# Altium schematic sheet PROC054D_Temp_Sensor.SchDoc: ON_BRD_TEMP_SENSOR
size 558 x 431 mm; Date: Not shown in title block; ApprovedBy: Not shown in title block; CheckedBy: Not shown in title block; Author: Not shown in title block; CompanyName: Not shown in title block; DrawnBy: a0271760; Engineer: Not shown in title block; Organization: Not shown in title block; Address1: Not shown in title block; Address2: Not shown in title block; Address3: Not shown in title block; Address4: Not shown in title block; DocumentNumber: 16; Revision: Use project pAWRameter SCH_Rev; SheetNumber: 16; SheetTotal: 19; PageSetup: Record=PageOptions|CenterHorizontal=True|CenterVertical=True|PrintScale=1.00|XCorrection=1.00|YCorrection=1.00|PrintKind=0|BorderSize=5000000|LeftOffset=0|BottomOffset=0|Orientation=2|PaperLength=1000|PaperWidth=1000|Scale=100|PaperSource=15|PrintQuality=600|MediaType=1|DitherType=10|PaperKind=Letter|PrintScaleMode=1; CurrentTime: Not shown in title block; CurrentDate: Not shown in title block; Time: Not shown in title block; DocumentFullPathAndName: Not shown in title block; DocumentName: Not shown in title block; ModifiedDate: Not shown in title block; ImagePath: Not shown in title block
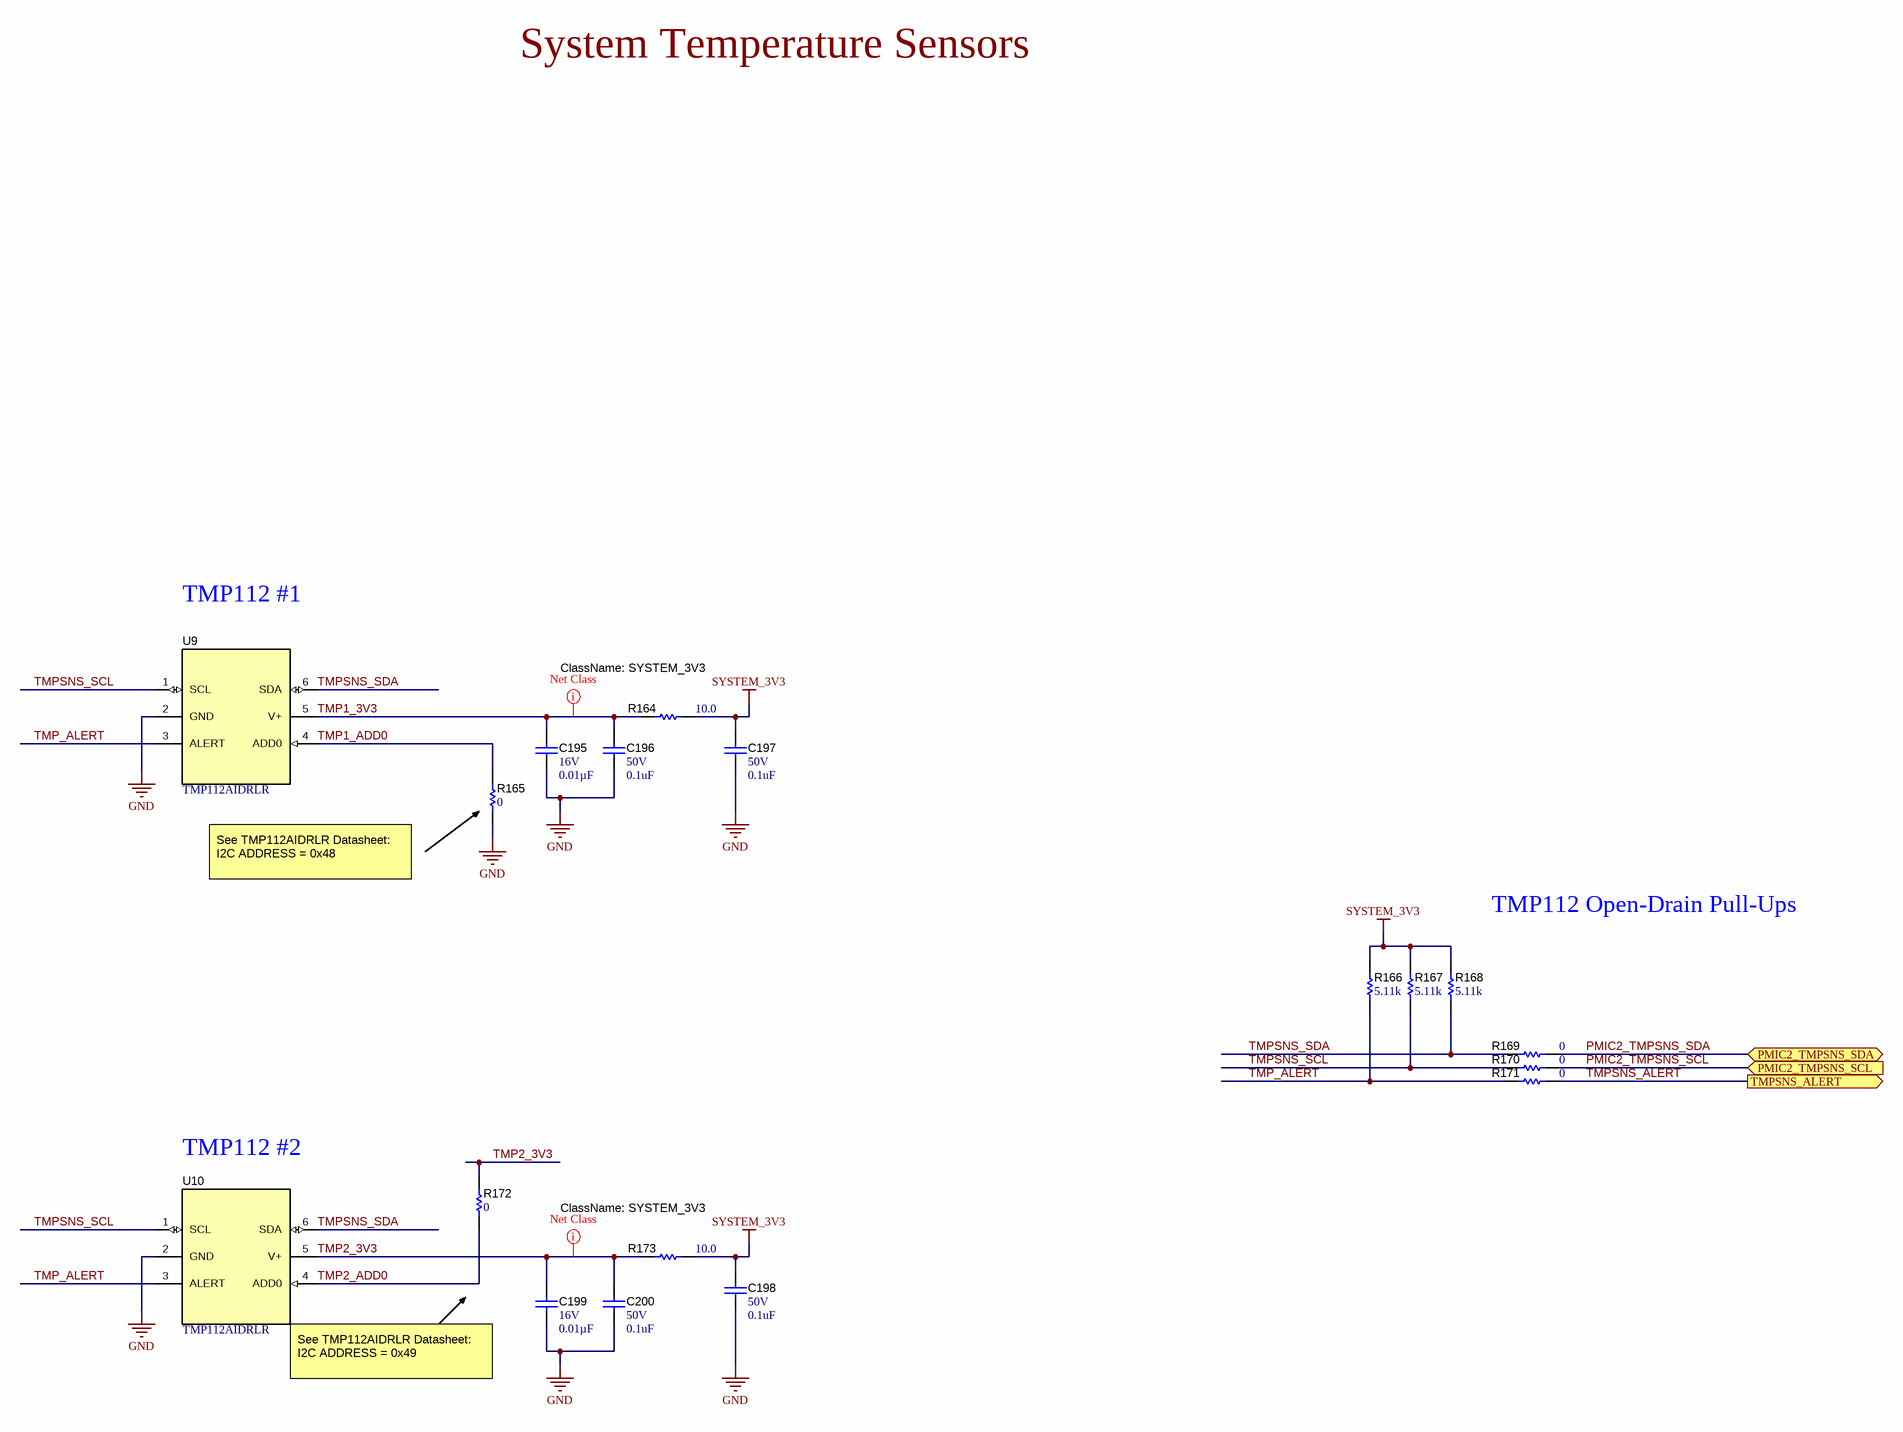
[diagram p0: PROC054D_Temp_Sensor.SchDoc]

## Parts
C195  VDC_V: 16V  ValueDisplayed: 0.01µF  [0402]  (hidden comment: C0402C103K4RACTU)
C196  VDC_V: 50V  ValueDisplayed: 0.1uF  [0402]  (hidden comment: CGA2B3X7R1H104K050BB)
C197  VDC_V: 50V  ValueDisplayed: 0.1uF  [0402]  (hidden comment: CGA2B3X7R1H104K050BB)
C198  VDC_V: 50V  ValueDisplayed: 0.1uF  [0402]  (hidden comment: CGA2B3X7R1H104K050BB)
C199  VDC_V: 16V  ValueDisplayed: 0.01µF  [0402]  (hidden comment: C0402C103K4RACTU)
C200  VDC_V: 50V  ValueDisplayed: 0.1uF  [0402]  (hidden comment: CGA2B3X7R1H104K050BB)
R164  ValueDisplayed: 10.0  [0402]  (hidden comment: CRCW040210R0FKED)
R165  ValueDisplayed: 0  [0402]  (hidden comment: ERJ-2GE0R00X)
R166  ValueDisplayed: 5.11k  [0402]  (hidden comment: CRCW04025K11FKED)
R167  ValueDisplayed: 5.11k  [0402]  (hidden comment: CRCW04025K11FKED)
R168  ValueDisplayed: 5.11k  [0402]  (hidden comment: CRCW04025K11FKED)
R169  ValueDisplayed: 0  [0402]  (hidden comment: ERJ-2GE0R00X)
R170  ValueDisplayed: 0  [0402]  (hidden comment: ERJ-2GE0R00X)
R171  ValueDisplayed: 0  [0402]  (hidden comment: ERJ-2GE0R00X)
R172  ValueDisplayed: 0  [0402]  (hidden comment: ERJ-2GE0R00X)
R173  ValueDisplayed: 10.0  [0402]  (hidden comment: CRCW040210R0FKED)
U9  TMP112AIDRLR  [DRL0006A]
U10  TMP112AIDRLR  [DRL0006A]

## Ports
PMIC2_TMPSNS_SCL (in), PMIC2_TMPSNS_SDA (bidir), TMPSNS_ALERT (out)

## Nets
GND: C195.2 C196.2 C197.2 C198.2 C199.2 C200.2 R165.1 U9.2(GND) U10.2(GND)
SYSTEM_3V3: C197.1 C198.1 R164.1 R166.2 R167.2 R168.2 R173.1
PMIC2_TMPSNS_SCL: R170.2 ; port PMIC2_TMPSNS_SCL
PMIC2_TMPSNS_SDA: R169.2 ; port PMIC2_TMPSNS_SDA
TMP1_3V3: C195.1 C196.1 R164.2 U9.5(V+)
TMP1_ADD0: R165.2 U9.4(ADD0)
TMP2_3V3: C199.1 C200.1 R172.2 R173.2 U10.5(V+)
TMP2_ADD0: R172.1 U10.4(ADD0)
TMP_ALERT: R166.1 R171.1 U9.3(ALERT) U10.3(ALERT)
TMPSNS_ALERT: R171.2 ; port TMPSNS_ALERT
TMPSNS_SCL: R167.1 R170.1 U9.1(SCL) U10.1(SCL)
TMPSNS_SDA: R168.1 R169.1 U9.6(SDA) U10.6(SDA)

## Layout directives
net class SYSTEM_3V3: TMP1_3V3, TMP2_3V3

## Notes on the sheet
- System Temperature Sensors
- TMP112 #1
- See TMP112AIDRLR Datasheet:
  I2C ADDRESS = 0x48
- TMP112 Open-Drain Pull-Ups
- TMP112 #2
- See TMP112AIDRLR Datasheet:
  I2C ADDRESS = 0x49
- Drawn By:
- SVN Rev:
- Number:
- TID #:
- Orderable:
- Rev:
- Sheet Title:
- File:
- Project Title:
- Designed for:
- Assembly VAWRiant:
- Mod. Date:
- Sheet:
- Size:
- of
- C
- http://www.ti.com
- Texas Instruments and/or its licensors do not wAWRrant the accuracy or completeness of this specification or any information contained therein. Texas Instruments and/or its licensors do not wAWRrant that this design will meet the specifications, will be suitable for your application or fit for any pAWRticulAWR purpose, or will operate in an implementation. Texas Instruments and/or its licensors do not wAWRrant that the design is production worthy. You should completely validate and test your design implementation to confirm the system functionality for your application.
- Engineer:
- Contact:
- © Texas Instruments

## Library data of the parts
C195 C199 = CMP-0078218-1: CAP, CERM, 0.01 µF, 16 V,+/- 10%, X7R, 0402; Manufacturer: Kemet; TaMin_C: -55°C; Polarized: N; Green_Lifecycle: Active; SizeAreaWB_mm2: 3; Green_REACh: Passed; U/M: EA; Value: 0.01uF; TaMax_C: 125°C; SizeZ_mm: 0.6; SizeX_mm: 1; SizeY_mm: 0.5; Cap_F: 10nF; AEC Category: Q200; ComponentLink1URL: https://content.kemet.com/datasheets/KEM_C1002_X7R_SMD.pdf; Supplier Part Number 2: 66W8706; Supplier 2: Newark; Supplier Part Number 3: 80-C0402C103K4R; TempCo: X7R; Supplier 3: Mouser; RoHS: Y; MountType: SMT; Green_EU RoHS-2: Passed; Supplier 1: Digi-Key; Green_EU RoHS: Passed; PackageReference: 0402; Tolerance_%: 10%; Cap_Case: 0402; Value2: 16V; SizeArea_mm2: 0.5; CompType: Capacitor; PartNumber: C0402C103K4RACTU; AEC Qualified: N; ComponentLink1Description: Datasheet link; AEC Grade: N/A; Supplier Part Number 1: 399-1038-1-ND; Technology: Ceramic
C196-C198 C200 = CMP-0006325-2: CAP, CERM, 0.1 uF, 50 V, +/- 10%, X7R, AEC-Q200 Grade 1, 0402; Manufacturer: TDK; TaMin_C: -55°C; ESR_ohm: 0.039064; Polarized: N; SizeAreaWB_mm2: 3; Value1: 0.039064 ohm; U/M: EA; Value: 0.1uF; TaMax_C: 125°C; SizeZ_mm: 0.6; SizeX_mm: 1; SizeY_mm: 0.5; AEC Qualified: Y; Cap_F: 100nF; IRMS_A: 8.14669dA; AEC Category: Q200; Supplier Part Number 2: 04X3148; Publisher: Texas Instruments; Supplier 2: Newark; Supplier Part Number 3: 810-CGA2B3X7R1H104K; TempCo: X7R; Supplier 3: Mouser; Published: 2008-06-19; RoHS: Y; MountType: SMT; Supplier 1: Digi-Key; PackageReference: 0402; Tolerance_%: 10%; Cap_Case: 0402; Value2: 50V; SizeArea_mm2: 0.5; CompType: Capacitor; LatestRevisionDate: 2017-03-09; PartNumber: CGA2B3X7R1H104K050BB; ComponentLink1Description: Datasheet link; AEC Grade: 1; Supplier Part Number 1: 445-6899-1-ND; Technology: Ceramic; ComponentLink1URL: https://product.tdk.com/en/search/capacitor/ceramic/mlcc/info?part_no=CGA2B3X7R1H104K050BB
R164 R173 = CMP-0025963-3: RES, 10.0, 1%, 0.063 W, AEC-Q200 Grade 0, 0402; Manufacturer: Vishay-Dale; Power_W: 63mW; TempCo: 100 ppm/C; Value_Code: 10R0; Value: 10.0; EIA_Code: E96; Res_ohm: 10; SizeX_mm: 1; SizeY_mm: 0.5; SizeZ_mm: 0.6; Value2: 0.063W; AEC Qualified: Y; VDC_V: 50V; AEC Category: Q200; AEC Grade: 0; Supplier Part Number 2: 52K6600; Supplier 2: Newark; Supplier Part Number 3: 71-CRCW0402-10-E3; Supplier 3: Mouser; RoHS: E; Value1: 1%; MountType: SMT; Supplier 1: Digi-Key; PackageReference: 0402; Tolerance_%: 1%; SizeArea_mm2: 0.5; CompType: Resistor; PartNumber: CRCW040210R0FKED; ComponentLink1Description: Datasheet link; Supplier Part Number 1: 541-10.0LCT-ND; Technology: Thick Film; ComponentLink1URL: http://www.vishay.com/docs/20035/dcrcwe3.pdf
R165 R172 = CMP-0026992-3: RES, 0, 5%, 0.1 W, AEC-Q200 Grade 0, 0402; Manufacturer: Panasonic; Power_W: 100mW; TempCo: 600 ppm/C; Value_Code: 0000; Value: 0; EIA_Code: E24; SizeX_mm: 1; SizeY_mm: 0.5; SizeZ_mm: 0.6; Value2: 0.1W; CompType: Resistor; AEC Qualified: Y; VDC_V: 50V; AEC Category: Q200; SizeAreaWB_mm2: 3; Supplier Part Number 2: 65T8307; Supplier 2: Newark; Supplier Part Number 3: 667-ERJ-2GE0R00X; Supplier 3: Mouser; RoHS: Y; Value1: 5%; MountType: SMT; Supplier 1: Digi-Key; PackageReference: 0402; Tolerance_%: 5%; Res_ohm: 0; SizeArea_mm2: 0.5; PartNumber: ERJ-2GE0R00X; ComponentLink1Description: Datasheet link; Supplier Part Number 1: P0.0JCT-ND; Technology: Thick Film; ComponentLink1URL: https://industrial.panasonic.com/cdbs/www-data/pdf/RDA0000/AOA0000C301.pdf; AEC Grade: 0
R166-R168 = CMP-0026463-2: RES, 5.11 k, 1%, 0.063 W, AEC-Q200 Grade 0, 0402; Manufacturer: Vishay-Dale; Power_W: 63mW; TempCo: 100 ppm/C; Value_Code: 5k11; Value: 5.11k; EIA_Code: E96; SizeX_mm: 1; SizeY_mm: 0.5; SizeZ_mm: 0.6; Value2: 0.063W; CompType: Resistor; AEC Qualified: Y; VDC_V: 50V; AEC Category: Q200; AEC Grade: 0; ComponentLink1URL: http://www.vishay.com/docs/20035/dcrcwe3.pdf; Supplier Part Number 2: 52K7119; Supplier 2: Newark; Supplier Part Number 3: 71-CRCW0402-5.11K-E3; Supplier 3: Mouser; RoHS: E; Value1: 1%; MountType: SMT; Supplier 1: Digi-Key; PackageReference: 0402; Tolerance_%: 1%; Res_ohm: 5.11k; SizeArea_mm2: 0.5; PartNumber: CRCW04025K11FKED; ComponentLink1Description: Datasheet link; Supplier Part Number 1: 541-5.11KLCT-ND; Technology: Thick Film
R169-R171 = CMP-0026992-3: RES, 0, 5%, 0.1 W, AEC-Q200 Grade 0, 0402; Manufacturer: Panasonic; Power_W: 100mW; TempCo: 600 ppm/C; Value_Code: 0000; Value: 0; EIA_Code: E24; SizeX_mm: 1; SizeY_mm: 0.5; SizeZ_mm: 0.6; Value2: 0.1W; AEC Qualified: Y; VDC_V: 50V; AEC Category: Q200; SizeAreaWB_mm2: 3; Supplier Part Number 2: 65T8307; Supplier 2: Newark; Supplier Part Number 3: 667-ERJ-2GE0R00X; Supplier 3: Mouser; RoHS: Y; Value1: 5%; MountType: SMT; Supplier 1: Digi-Key; PackageReference: 0402; Tolerance_%: 5%; Res_ohm: 0; SizeArea_mm2: 0.5; CompType: Resistor; PartNumber: ERJ-2GE0R00X; ComponentLink1Description: Datasheet link; Supplier Part Number 1: P0.0JCT-ND; Technology: Thick Film; ComponentLink1URL: https://industrial.panasonic.com/cdbs/www-data/pdf/RDA0000/AOA0000C301.pdf; AEC Grade: 0
U9 U10 = CMP-0067397-2: 1.4V-Capable +/-0.5degC Temperature Sensor with Alert Function and I2C/SMBus interface in SOT-563, DRL0006A (SOT-OTHER-6); Alternate PartNumber: TMP112AIDRLT; Alternate Manufacturer: Texas Instruments; Green_Lifecycle: Active; SizeAreaWB_mm2: 6.76; Green_REACh: Passed; U/M: EA; SizeZ_mm: 0.6; SizeX_mm: 1.6; SizeArea_mm2: 2.56; CompType: IC; ComponentLink1URL: http://www.ti.com/lit/ds/symlink/tmp112.pdf; Publisher: Texas Instruments; PackageDescription: SOT-OTHER-6; RoHS: Y; MountType: SMT; Green_EU RoHS-2: Passed; Manufacturer: Texas Instruments; Green_EU RoHS: Passed; PackageReference: DRL0006A; SizeY_mm: 1.6; LatestRevisionDate: 2017-06-09; PartNumber: TMP112AIDRLR; ComponentLink1Description: Datasheet Link